# Altium schematic sheet sine_wave_generator.SchDoc
size A4
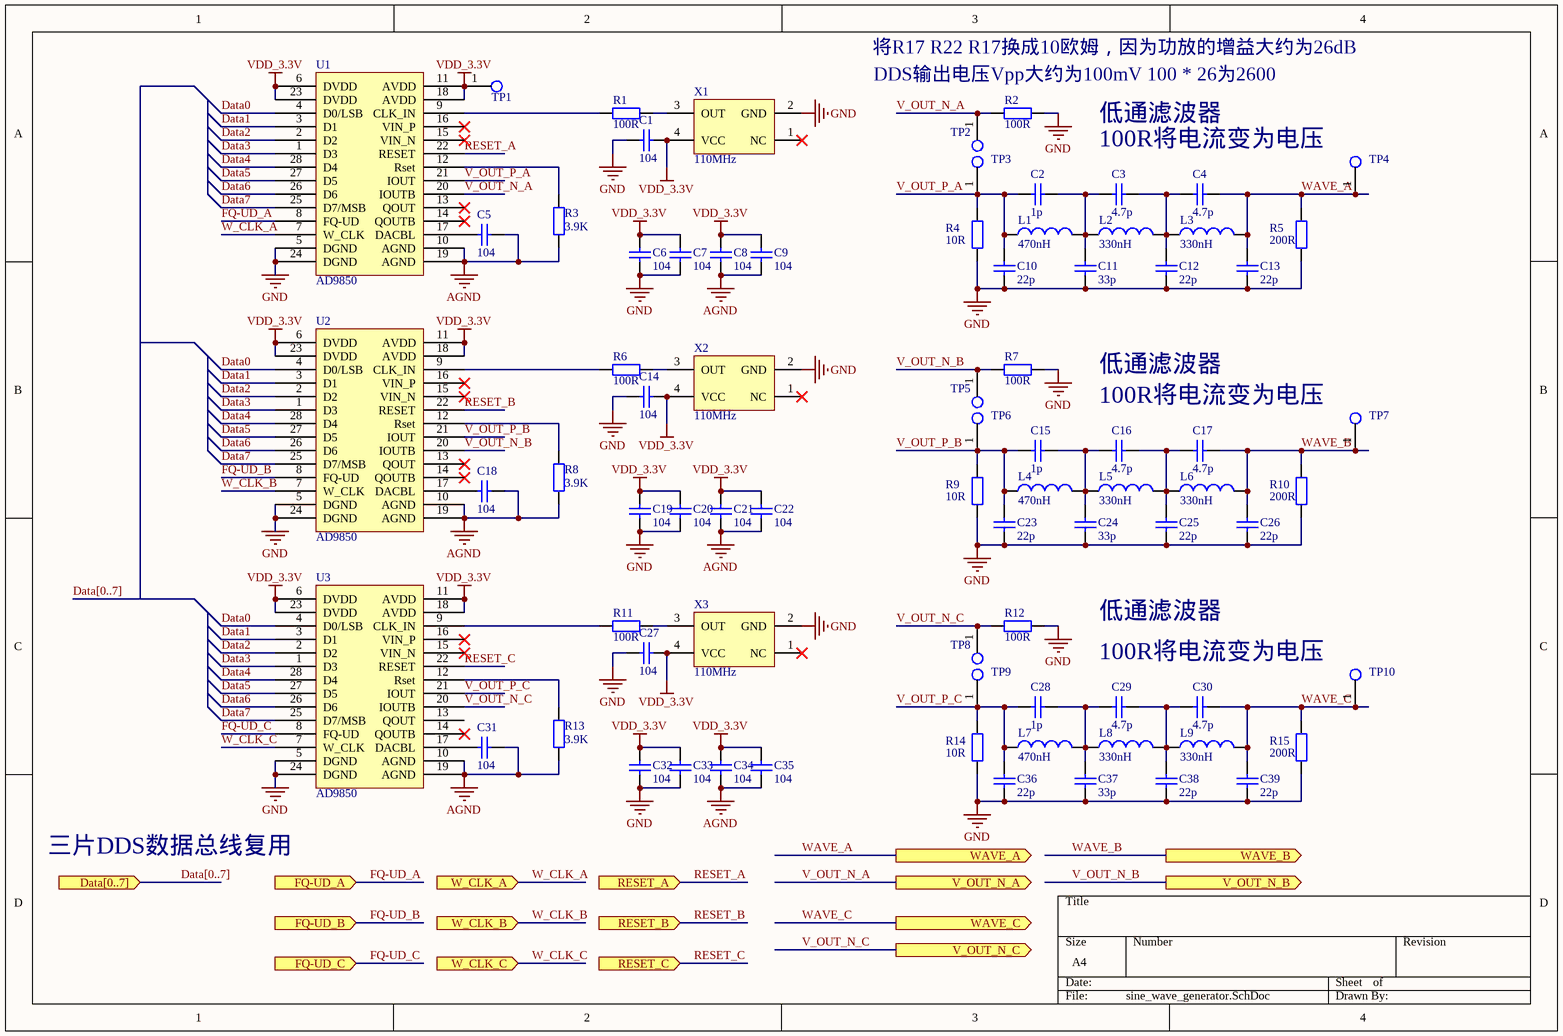
[diagram p0: sine_wave_generator.SchDoc]

## Parts
C1  value 104  [0805]  (hidden comment: Cap)
C2  value 1p  [0805]  (hidden comment: Cap)
C3  value 4.7p  [0805]  (hidden comment: Cap)
C4  value 4.7p  [0805]  (hidden comment: Cap)
C5  value 104  [0805]  (hidden comment: Cap)
C6  value 104  [0805]  (hidden comment: Cap)
C7  value 104  [0805]  (hidden comment: Cap)
C8  value 104  [0805]  (hidden comment: Cap)
C9  value 104  [0805]  (hidden comment: Cap)
C10  value 22p  [0805]  (hidden comment: Cap)
C11  value 33p  [0805]  (hidden comment: Cap)
C12  value 22p  [0805]  (hidden comment: Cap)
C13  value 22p  [0805]  (hidden comment: Cap)
C14  value 104  [0805]  (hidden comment: Cap)
C15  value 1p  [0805]  (hidden comment: Cap)
C16  value 4.7p  [0805]  (hidden comment: Cap)
C17  value 4.7p  [0805]  (hidden comment: Cap)
C18  value 104  [0805]  (hidden comment: Cap)
C19  value 104  [0805]  (hidden comment: Cap)
C20  value 104  [0805]  (hidden comment: Cap)
C21  value 104  [0805]  (hidden comment: Cap)
C22  value 104  [0805]  (hidden comment: Cap)
C23  value 22p  [0805]  (hidden comment: Cap)
C24  value 33p  [0805]  (hidden comment: Cap)
C25  value 22p  [0805]  (hidden comment: Cap)
C26  value 22p  [0805]  (hidden comment: Cap)
C27  value 104  [0805]  (hidden comment: Cap)
C28  value 1p  [0805]  (hidden comment: Cap)
C29  value 4.7p  [0805]  (hidden comment: Cap)
C30  value 4.7p  [0805]  (hidden comment: Cap)
C31  value 104  [0805]  (hidden comment: Cap)
C32  value 104  [0805]  (hidden comment: Cap)
C33  value 104  [0805]  (hidden comment: Cap)
C34  value 104  [0805]  (hidden comment: Cap)
C35  value 104  [0805]  (hidden comment: Cap)
C36  value 22p  [0805]  (hidden comment: Cap)
C37  value 33p  [0805]  (hidden comment: Cap)
C38  value 22p  [0805]  (hidden comment: Cap)
C39  value 22p  [0805]  (hidden comment: Cap)
L1  470nH  [0805L]
L2  330nH  [0805L]
L3  330nH  [0805L]
L4  470nH  [0805L]
L5  330nH  [0805L]
L6  330nH  [0805L]
L7  470nH  [0805L]
L8  330nH  [0805L]
L9  330nH  [0805L]
R1  value 100R  [0805]  (hidden comment: Res)
R2  value 100R  [0805]  (hidden comment: Res)
R3  value 3.9K  [0805]  (hidden comment: Res)
R4  value 10R  [0805]  (hidden comment: Res)
R5  value 200R  [0805]  (hidden comment: Res)
R6  value 100R  [0805]  (hidden comment: Res)
R7  value 100R  [0805]  (hidden comment: Res)
R8  value 3.9K  [0805]  (hidden comment: Res)
R9  value 10R  [0805]  (hidden comment: Res)
R10  value 200R  [0805]  (hidden comment: Res)
R11  value 100R  [0805]  (hidden comment: Res)
R12  value 100R  [0805]  (hidden comment: Res)
R13  value 3.9K  [0805]  (hidden comment: Res)
R14  value 10R  [0805]  (hidden comment: Res)
R15  value 200R  [0805]  (hidden comment: Res)
TP1  testPoint  [TP_H]  (value not drawn)
TP2  testPoint  [TP_H]  (value not drawn)
TP3  testPoint  [TP_H]  (value not drawn)
TP4  testPoint  [TP_H]  (value not drawn)
TP5  testPoint  [TP_H]  (value not drawn)
TP6  testPoint  [TP_H]  (value not drawn)
TP7  testPoint  [TP_H]  (value not drawn)
TP8  testPoint  [TP_H]  (value not drawn)
TP9  testPoint  [TP_H]  (value not drawn)
TP10  testPoint  [TP_H]  (value not drawn)
U1  AD9850  [SOP65P780X198-28N]
U2  AD9850  [SOP65P780X198-28N]
U3  AD9850  [SOP65P780X198-28N]
X1  110MHz  [3225]
X2  110MHz  [3225]
X3  110MHz  [3225]

## Ports
Data[0..7] (in), FQ-UD_A (in), FQ-UD_B (in), FQ-UD_C (in), RESET_A (in), RESET_B (in), RESET_C (in), V_OUT_N_A (out), V_OUT_N_B (out), V_OUT_N_C (out), W_CLK_A (in), W_CLK_B (in), W_CLK_C (in), WAVE_A (out), WAVE_B (out), WAVE_C (out)

## Nets
AGND: C5.2 C8.1 C9.1 C18.2 C21.1 C22.1 C31.1 C34.1 C35.1 R3.1 R8.1 R13.1 U1.10(AGND) U1.19(AGND) U2.10(AGND) U2.19(AGND) U3.10(AGND) U3.19(AGND)
GND: C1.1 C6.1 C7.1 C10.1 C11.1 C12.1 C13.1 C14.1 C19.1 C20.1 C23.1 C24.1 C25.1 C26.1 C27.2 C32.1 C33.1 C36.1 C37.1 C38.1 C39.1 R2.2 R4.1 R5.1 R7.2 R9.1 R10.1 R12.2 R14.1 R15.1 U1.5(DGND) U1.24(DGND) U2.5(DGND) U2.24(DGND) U3.5(DGND) U3.24(DGND) X1.2(GND) X2.2(GND) X3.2(GND)
VDD_3.3V: C1.2 C6.2 C7.2 C8.2 C9.2 C14.2 C19.2 C20.2 C21.2 C22.2 C27.1 C32.2 C33.2 C34.2 C35.2 TP1.1 U1.6(DVDD) U1.11(AVDD) U1.18(AVDD) U1.23(DVDD) U2.6(DVDD) U2.11(AVDD) U2.18(AVDD) U2.23(DVDD) U3.6(DVDD) U3.11(AVDD) U3.18(AVDD) U3.23(DVDD) X1.4(VCC) X2.4(VCC) X3.4(VCC)
Data0: U1.4(D0/LSB) U2.4(D0/LSB) U3.4(D0/LSB)
Data1: U1.3(D1) U2.3(D1) U3.3(D1)
Data2: U1.2(D2) U2.2(D2) U3.2(D2)
Data3: U1.1(D3) U2.1(D3) U3.1(D3)
Data4: U1.28(D4) U2.28(D4) U3.28(D4)
Data5: U1.27(D5) U2.27(D5) U3.27(D5)
Data6: U1.26(D6) U2.26(D6) U3.26(D6)
Data7: U1.25(D7/MSB) U2.25(D7/MSB) U3.25(D7/MSB)
FQ-UD_A: U1.8(FQ-UD) ; port FQ-UD_A
FQ-UD_B: U2.8(FQ-UD) ; port FQ-UD_B
FQ-UD_C: U3.8(FQ-UD) ; port FQ-UD_C
RESET_A: U1.22(RESET) ; port RESET_A
RESET_B: U2.22(RESET) ; port RESET_B
RESET_C: U3.22(RESET) ; port RESET_C
V_OUT_N_A: R2.1 TP2.1 U1.20(IOUTB) ; port V_OUT_N_A
V_OUT_N_B: R7.1 TP5.1 U2.20(IOUTB) ; port V_OUT_N_B
V_OUT_N_C: R12.1 TP8.1 U3.20(IOUTB) ; port V_OUT_N_C
V_OUT_P_A: C2.1 C10.2 L1.1 R4.2 TP3.1 U1.21(IOUT)
V_OUT_P_B: C15.1 C23.2 L4.1 R9.2 TP6.1 U2.21(IOUT)
V_OUT_P_C: C28.1 C36.2 L7.1 R14.2 TP9.1 U3.21(IOUT)
W_CLK_A: U1.7(W_CLK) ; port W_CLK_A
W_CLK_B: U2.7(W_CLK) ; port W_CLK_B
W_CLK_C: U3.7(W_CLK) ; port W_CLK_C
WAVE_A: C4.2 C13.2 L3.2 R5.2 TP4.1 ; port WAVE_A
WAVE_B: C17.2 C26.2 L6.2 R10.2 TP7.1 ; port WAVE_B
WAVE_C: C30.2 C39.2 L9.2 R15.2 TP10.1 ; port WAVE_C
NetC2_2: C2.2 C3.1 C11.2 L1.2 L2.1
NetC3_2: C3.2 C4.1 C12.2 L2.2 L3.1
NetC5_1: C5.1 U1.17(DACBL)
NetC15_2: C15.2 C16.1 C24.2 L4.2 L5.1
NetC16_2: C16.2 C17.1 C25.2 L5.2 L6.1
NetC18_1: C18.1 U2.17(DACBL)
NetC28_2: C28.2 C29.1 C37.2 L7.2 L8.1
NetC29_2: C29.2 C30.1 C38.2 L8.2 L9.1
NetC31_2: C31.2 U3.17(DACBL)
NetR1_1: R1.1 U1.9(CLK_IN)
NetR1_2: R1.2 X1.3(OUT)
NetR3_2: R3.2 U1.12(Rset)
NetR6_1: R6.1 U2.9(CLK_IN)
NetR6_2: R6.2 X2.3(OUT)
NetR8_2: R8.2 U2.12(Rset)
NetR11_1: R11.1 U3.9(CLK_IN)
NetR11_2: R11.2 X3.3(OUT)
NetR13_2: R13.2 U3.12(Rset)

Not connected (* = marked no-connect by the designer): U1 13(QOUT)* 14(QOUTB)* 15(VIN_N)* 16(VIN_P)*; U2 13(QOUT)* 14(QOUTB)* 15(VIN_N)* 16(VIN_P)*; U3 13(QOUT) 14(QOUTB)* 15(VIN_N)* 16(VIN_P)*; X1 1(NC)*; X2 1(NC)*; X3 1(NC)*

## Buses and harness runs
bus Data[0..7]
bus Data[0..7] = port Data[0..7]

## Notes on the sheet
- 将R17 R22 R17换成10欧姆，因为功放的增益大约为26dB
- (near R2) DDS输出电压Vpp大约为100mV 100 * 26为2600
- 低通滤波器
- 100R将电流变为电压
- 三片DDS数据总线复用

## Library data of the parts
C1-C39 = Cap: 原理图绘制者: 刘永钦; 原理图何处使用过: 2014年飞思卡尔底板; 原理图审核人1: 徐鹏飞; 封装0805何处使用: 2015年航行器遥控器; 原理图审核人2: 朱觉文; 封装0603何处使用过: 在2401转接板上使用; Pressure Voltage: 16V; 原理图提供者: 刘永钦; 封装0805绘制者: 刘永钦; 封装0805提供者: 刘永钦; 封装0805审核人1: 徐鹏飞; 封装0805审核人2: 朱觉文; 封装0603绘制者: 刘永钦; 封装0603提供者: 刘永钦; 封装0603审核人1: 朱觉文; 封装0603审核人2: 徐鹏飞
L1-L9 = Inductor
R1-R15 = Res: 原理图绘制者: 刘永钦; 原理图何处使用过: 2014年飞思卡尔底板; 原理图审核人1: 徐鹏飞; 封装0805何处使用过: 2015年航行器遥控器; 原理图审核人2: 朱觉文; 封装2512-RESC6332X06N何处使用过: 在无刷直流电机驱动板上使用过; 封装0603何处使用过: 在2401转接板上使用; 原理图提供者: 刘永钦; 封装0805绘制者: 刘永钦; 封装0805提供者: 刘永钦; 封装0805审核人1: 徐鹏飞; 封装0805审核人2: 朱觉文; 封装0603提供者: 刘永钦; 封装0603审核人2: 朱觉文; 封装0603审核人1: 徐鹏飞; 封装2512-RESC6332X06N审核人2: 朱觉文; 封装2512-RESC6332X06N提供者: 刘永钦; 封装2512-RESC6332X06N审核人1: 徐鹏飞; 封装0603绘制者: 刘永钦; 封装2512-RESC6332X06N绘制者: 刘永钦
TP1-TP10 = TP
X1-X3 = Oscillator